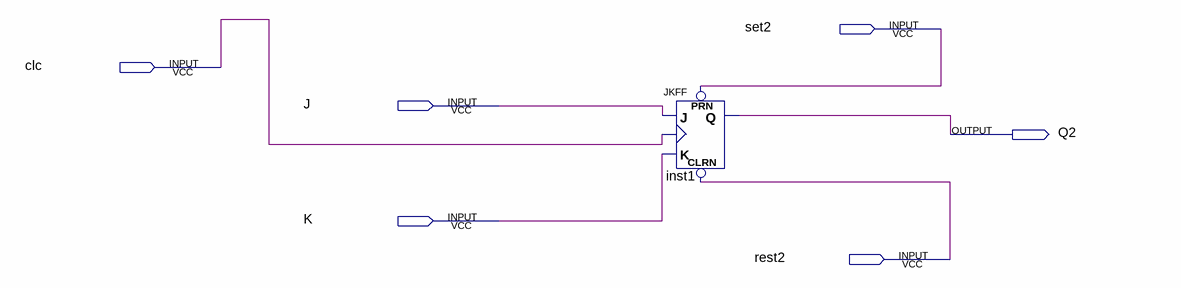
[diagram p0: schematic sheet]
// Quartus schematic Block3.bdf as structural Verilog: 1 symbols, 6 pins
module Block3 (
  input  set2,
  input  clc,
  input  J,
  input  K,
  input  rest2,
  output Q2
);

  JKFF inst1 (.PRN(set2), .CLRN(rest2), .K(K), .J(J), .CLK(clc), .Q(Q2));
endmodule
